# EAGLE schematic TSOC_RS485_EM_R4_0 (EAGLE 6.6.0)
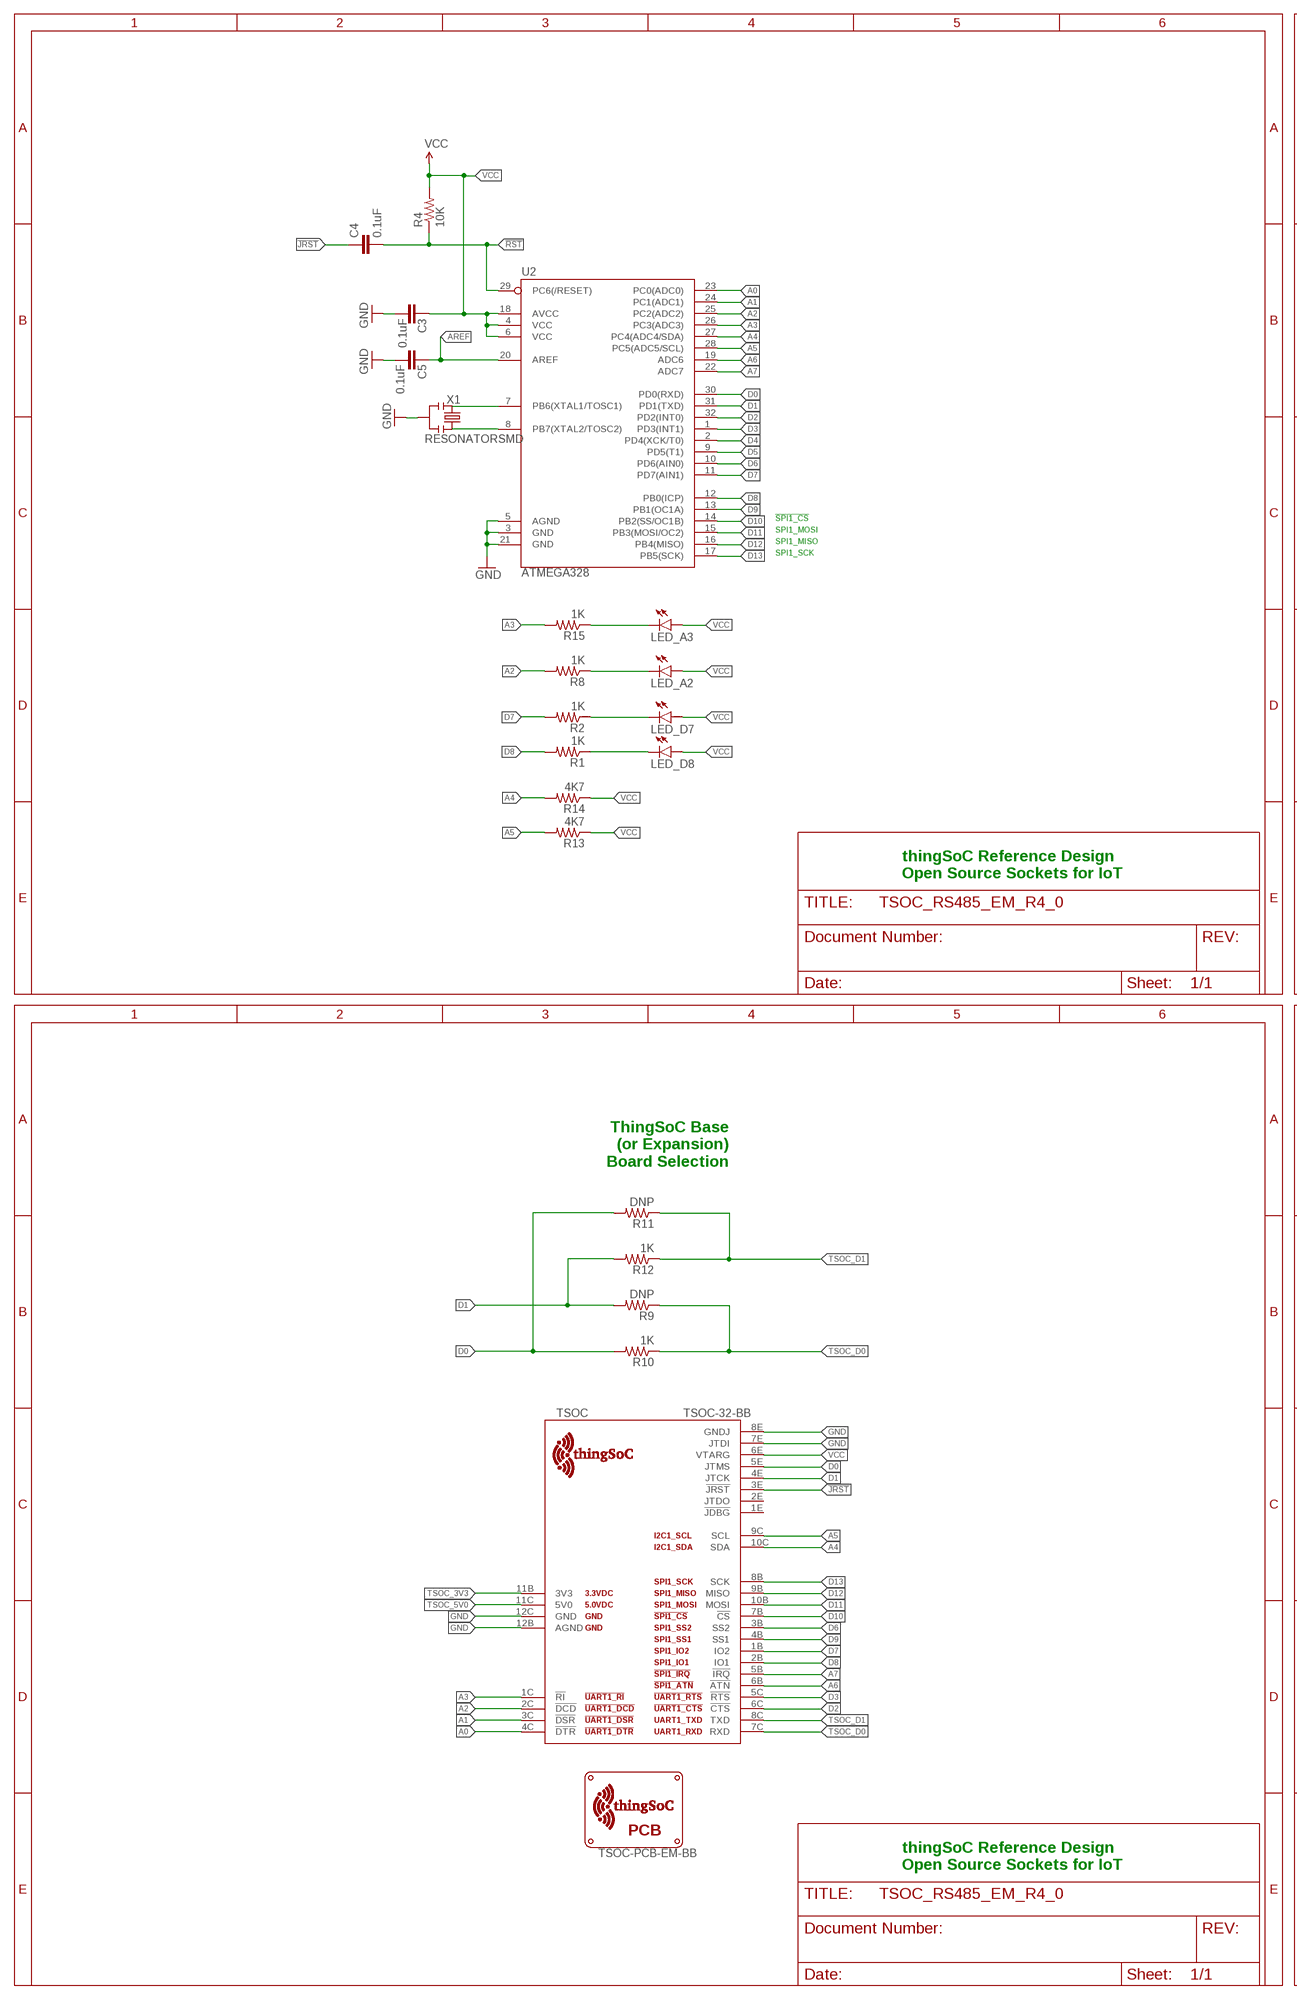
[diagram p0: schematic, sheet 1, part 1 of 2]
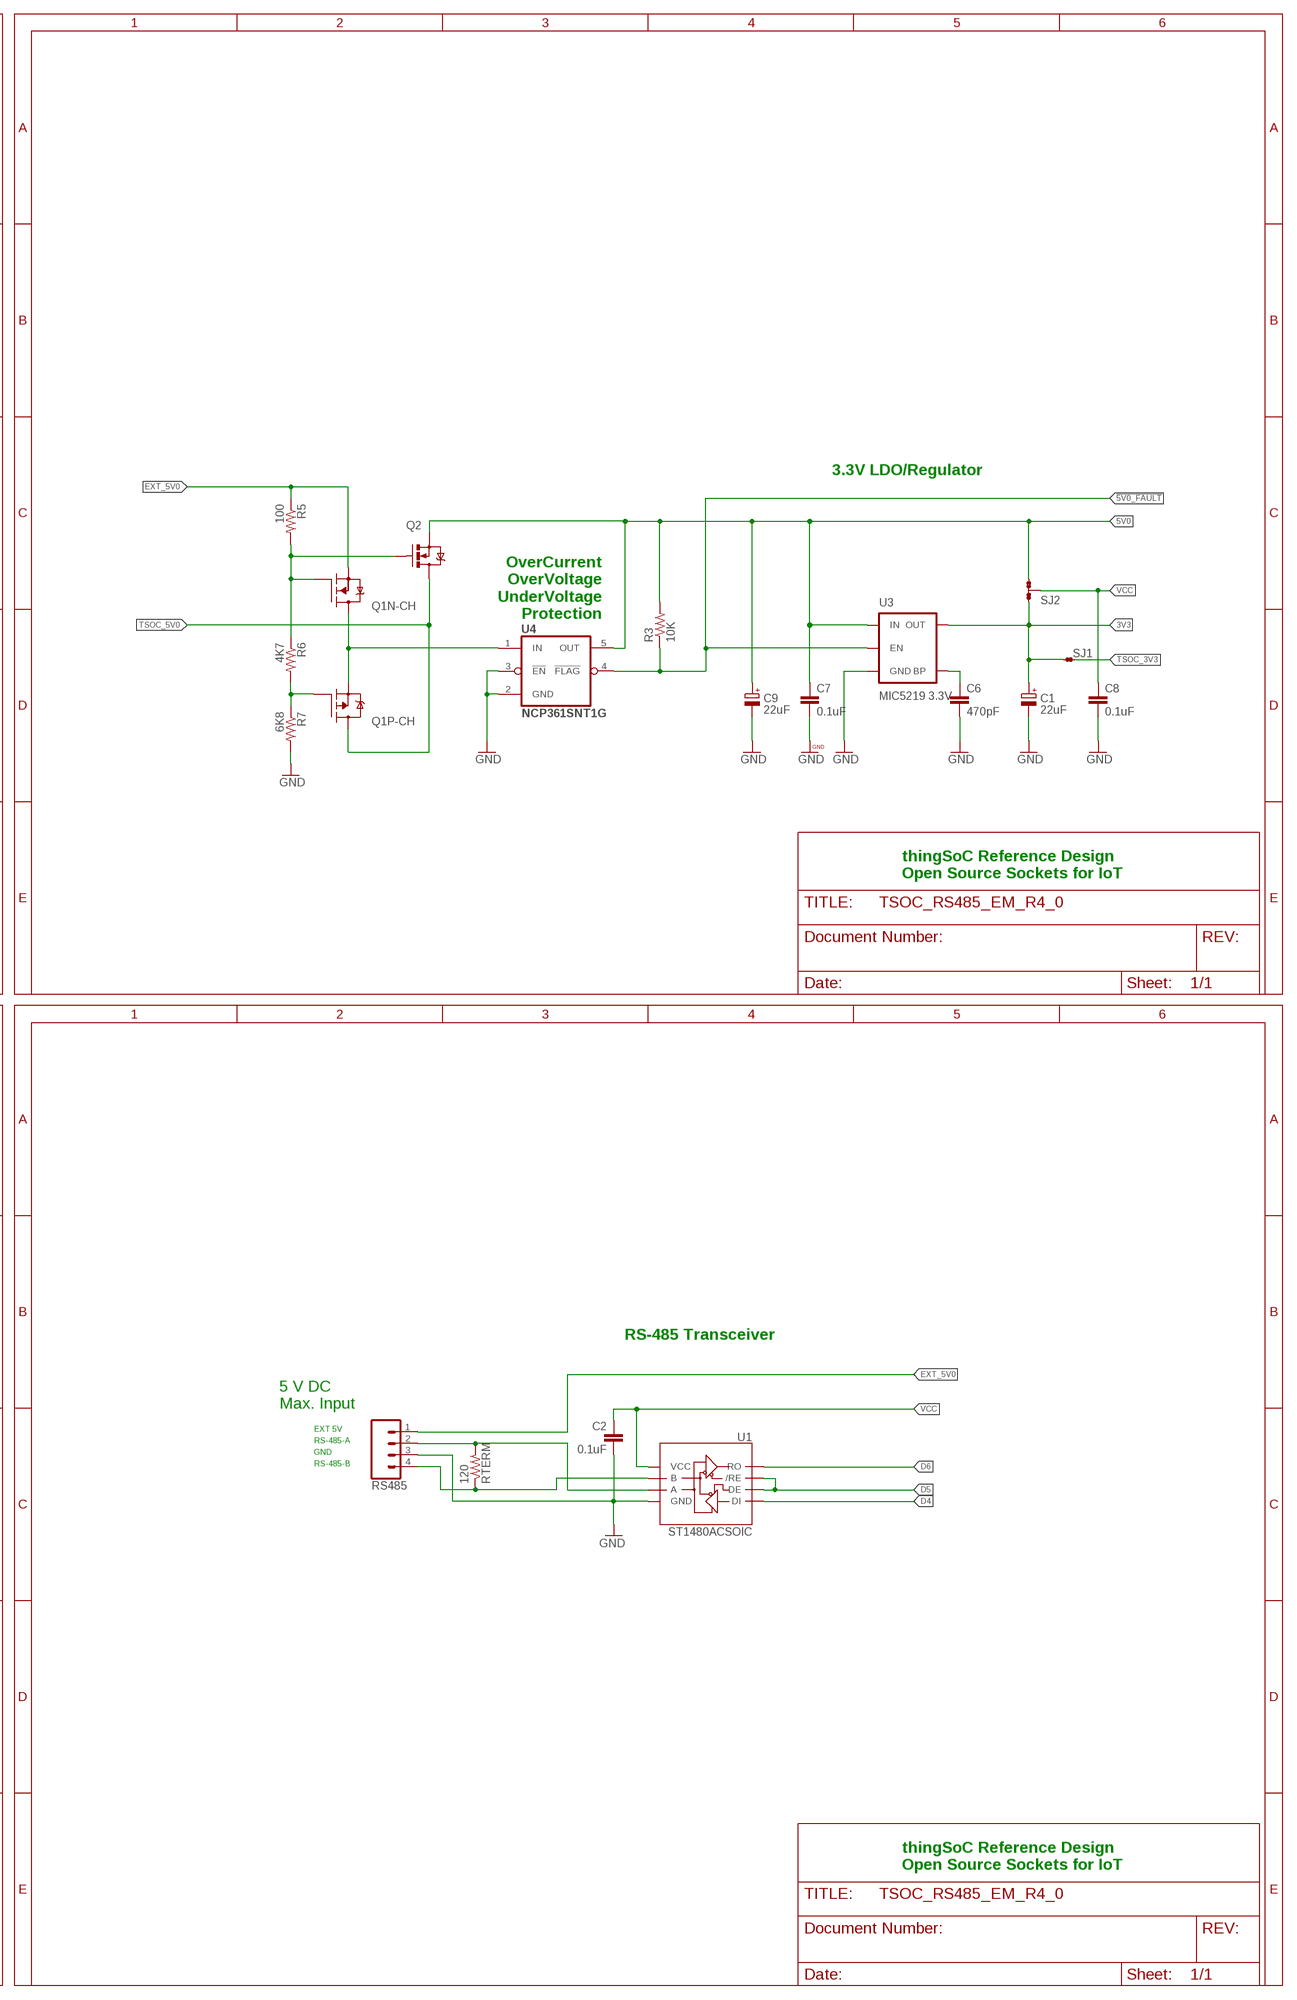
[diagram p1: schematic, sheet 1, part 2 of 2]

## Parts
C1  22uF  CPOL-EUSMCB  [SMC_B]
C2  0.1uF  CAP0402-CAP  [0402-CAP]
C3  0.1uF  CAP0402-CAP  [0402-CAP]
C4  0.1uF  CAP0402-CAP  [0402-CAP]
C5  0.1uF  CAP0402-CAP  [0402-CAP]
C6  470pF  CAP0402-CAP  [0402-CAP]
C7  0.1uF  CAP0402-CAP  [0402-CAP]
C8  0.1uF  CAP0402-CAP  [0402-CAP]
C9  22uF  CPOL-EUSMCB  [SMC_B]
LED_A2  LED0603  [LED-0603]
LED_A3  LED0603  [LED-0603]
LED_D7  LED0603  [LED-0603]
LED_D8  LED0603  [LED-0603]
Q1  FDC6420C  [SOT95P280X110-6N]
Q2  MOSFET-NCHANNELAO3404A  [SOT23-3]
R1  1K  RESISTOR0402  [0402-RES]
R2  1K  RESISTOR0402  [0402-RES]
R3  10K  RESISTOR0402  [0402-RES]
R4  10K  RESISTOR0402  [0402-RES]
R5  100  RESISTOR0402  [0402-RES]
R6  4K7  RESISTOR0402  [0402-RES]
R7  6K8  RESISTOR0402  [0402-RES]
R8  1K  RESISTOR0402  [0402-RES]
R9  DNP  RESISTOR0402  [0402-RES]
R10  1K  RESISTOR0402  [0402-RES]
R11  DNP  RESISTOR0402  [0402-RES]
R12  1K  RESISTOR0402  [0402-RES]
R13  4K7  RESISTOR0402  [0402-RES]
R14  4K7  RESISTOR0402  [0402-RES]
R15  1K  RESISTOR0402  [0402-RES]
RS485  M04SCREW  [SCREWTERMINAL-3.5MM-4]
RTERM  120  RESISTOR0402  [0402-RES]
SJ1  JMP-2-NC  [JMP-2-NC]
SJ2  JMP-3-1_2  [JMP-3-1_2]
TSOC  TSOC-32-BB  [TSOC-BB-S32]
U1  ST1480ACSOIC  [SO08]
U2  ATMEGA328  ATMEGA168  [TQFP32-08]
U3  MIC5219 3.3V  V_REG_MIC52193.3V  [SOT23-5]
U4  NCP361SNT1G  [SOP95P275X110-5N]
U$1  TSOC-PCB-EM-BB  [TSOC-EM-BB]
X1  RESONATORSMD  [RESONATOR-SMD]

## Nets
3V3: C1.+ SJ1.1 SJ2.1 U3.5(OUT)
5V0: C7.1 C9.+ Q2.2(S) R3.2 SJ2.3 U3.1(IN) U4.5(OUT)
!5V0_FAULT: R3.1 U3.3(EN) U4.4(!FLAG)
!JRST: C4.1 TSOC.3E(!JRST)
!RST: C4.2 R4.1 U2.29(PC6(/RESET))
A: RS485.4 RTERM.1 U1.7(B)
A0: TSOC.4C(!DTR) U2.23(PC0(ADC0))
A1: TSOC.3C(!DSR) U2.24(PC1(ADC1))
A2: R8.2 TSOC.2C(!DCD) U2.25(PC2(ADC2))
A3: R15.2 TSOC.1C(!RI) U2.26(PC3(ADC3))
A4: R14.2 TSOC.10C(SDA) U2.27(PC4(ADC4/SDA))
A5: R13.2 TSOC.9C(SCL) U2.28(PC5(ADC5/SCL))
A6: TSOC.6B(!ATN) U2.19(ADC6)
A7: TSOC.5B(!IRQ) U2.22(ADC7)
AREF: C5.2 U2.20(AREF)
B: RS485.2 RTERM.2 U1.6(A)
BYPASS1: C6.1 U3.4(BP)
D0: R10.2 R11.2 TSOC.5E(JTMS) U2.30(PD0(RXD))
D1: R9.2 R12.2 TSOC.4E(JTCK) U2.31(PD1(TXD))
D2: TSOC.6C(!CTS) U2.32(PD2(INT0))
D3: TSOC.5C(!RTS) U2.1(PD3(INT1))
D4: U1.4(DI) U2.2(PD4(XCK/T0))
D5: U1.2(/RE) U1.3(DE) U2.9(PD5(T1))
D6: TSOC.3B(SS2) U1.1(RO) U2.10(PD6(AIN0))
D7: R2.2 TSOC.1B(IO2) U2.11(PD7(AIN1))
D8: R1.2 TSOC.2B(IO1) U2.12(PB0(ICP))
D9: TSOC.4B(SS1) U2.13(PB1(OC1A))
D10: TSOC.7B(!CS) U2.14(PB2(SS/OC1B))
D11: TSOC.10B(MOSI) U2.15(PB3(MOSI/OC2))
D12: TSOC.9B(MISO) U2.16(PB4(MISO))
D13: TSOC.8B(SCK) U2.17(PB5(SCK))
EXT_5V0: Q1.5(N-CH:S) R5.1 RS485.1
GND: C1.- C2.2 C3.1 C5.1 C6.2 C7.2 C8.2 C9.- R7.2 RS485.3 TSOC.7E(JTDI) TSOC.8E(GNDJ) TSOC.12B(AGND) TSOC.12C(GND) U1.5(GND) U2.3(GND) U2.5(AGND) U2.21(GND) U3.2(GND) U4.2(GND) U4.3(!EN) X1.2
LED_A2: LED_A2.C R8.1
N$2: LED_D7.C R2.1
N$3: LED_A3.C R15.1
N$4: LED_D8.C R1.1
NGATE: Q1.1(N-CH:G) Q2.1(G) R5.2 R6.1
PGATE: Q1.3(P-CH:G) R6.2 R7.1
TSOC_3V3: SJ1.2 TSOC.11B(3V3)
TSOC_5V0: Q1.4(P-CH:D) Q2.3(D) TSOC.11C(5V0)
TSOC_D0: R9.1 R10.1 TSOC.7C(RXD)
TSOC_D1: R11.1 R12.1 TSOC.8C(TXD)
VCC: C2.1 C3.2 C8.1 LED_A2.A LED_A3.A LED_D7.A LED_D8.A R4.2 R13.1 R14.1 SJ2.2 TSOC.6E(VTARG) U1.8(VCC) U2.4(VCC) U2.6(VCC) U2.18(AVCC)
VIN: Q1.2(P-CH:S) Q1.6(N-CH:D) U4.1(IN)
XIN: U2.7(PB6(XTAL1/TOSC1)) X1.3
XOUT: U2.8(PB7(XTAL2/TOSC2)) X1.1
Unconnected: TSOC.1E(!JDBG) TSOC.2E(JTDO)

## Notes on the sheet
- 3.3V LDO/Regulator
- !SPI1_CS
- SPI1_MOSI
- SPI1_MISO
- SPI1_SCK
- OverCurrent
  OverVoltage
  UnderVoltage
  Protection
- thingSoC Reference Design
  Open Source Sockets for IoT
- thingSoC Reference Design
  Open Source Sockets for IoT
- ThingSoC Base
  (or Expansion)
  Board Selection
- RS-485 Transceiver
- 5 V DC 
  Max. Input
- EXT 5V
- RS-485-A
- GND
- RS-485-B
- thingSoC Reference Design
  Open Source Sockets for IoT
- thingSoC Reference Design
  Open Source Sockets for IoT

## Library data of the parts
C1 C9 = rcl:CPOL-EU: POLARIZED CAPACITOR, European symbol
C2-C8 = TSOC-MODBUS-ESM:CAP: Capacitor Standard 0603 ceramic capacitor, and 0.1" leaded capacitor.
LED_A2 LED_A3 LED_D7 LED_D8 = TSOC-MODBUS-ESM:LED: LEDs Standard schematic elements and footprints for 5mm, 3mm, 1206, and 0603 sized LEDs. 5mm - Spark Fun Electronics SKU : COM-00529 (and others)
Q1 = TSOC-ESP8266-BASE:FDC6420C: N and P Channel Power Trench MOSFETs
Q2 = SparkFun-DiscreteSemi:MOSFET-NCHANNEL: Common NMOSFET Parts MFG P/N Store ID Prod ID FDD8780 TRANS-09984 SI7820DN TRANS-11055 FDS6630A IC-08089 2N7002PW TRANS-11151 FQP30N06L COM-10213 TRANS-10060 BSS123LT1G TRANS-08345 BSS138 TRANS-00830 BS170 2N7000; PROD_ID: TRAN-12988
R1-R15 RTERM = TSOC-MODBUS-ESM:RESISTOR: Resistor Basic schematic elements and footprints for 0603, 1206, and PTH resistors.
RS485 = SparkFun-Connectors:M04: Header 4 Standard 4-pin 0.1" header. Use with straight break away headers (SKU : PRT-00116), right angle break away headers (PRT-00553), swiss pins (PRT-00743), machine pins (PRT-00117), and female headers (PRT-00115). Molex polarized connector foot print use with SKU : PRT-08231 with associated crimp pins and housings. 1MM SMD Version SKU: PRT-10208
SJ1 = TSOC-MODBUS-ESM:JMP-2-NC: Two Terminal Jumper - Normally Closed Positions 1 and 2 are normally connected. PatternAgents ProtoPads Library Schematic and PCB layout libraries for design patterns by PatternAgents. For the CADSoft Eagle CAD program : http://www.cadsoftusa.com/download-eagle/ Source LBR : http://www.patternagents.com Github : https://github.com/PatternAgents License : http://creativecommons.org/licenses/by-sa/4.0/ (Creative Commons 4.0) THIS SOFTWARE IS PROVIDED BY THE CONTRIBUTORS "AS IS" AND WITHOUT ANY EXPRESS OR IMPLIED WARRANTIES, INCLUDING, BUT NOT LIMITED TO, THE IMPLIED WARRANTIES OF MERCHANTABILITY AND FITNESS FOR A PARTICULAR PURPOSE ARE DISCLAIMED. IN NO EVENT SHALL THE COPYRIGHT OWNER OR CONTRIBUTORS BE LIABLE FOR ANY DIRECT, INDIRECT, INCIDENTAL, SPECIAL, EXEMPLARY, OR CONSEQUENTIAL DAMAGES (INCLUDING, BUT NOT LIMITED TO, PROCUREMENT OF SUBSTITUTE GOODS OR SERVICES; LOSS OF USE, DATA, OR PROFITS; OR BUSINESS INTERRUPTION) HOWEVER CAUSED AND ON ANY THEORY OF LIABILITY, WHETHER IN CONTRACT, STRICT LIABILITY, OR TORT (INCLUDING NEGLIGENCE OR OTHERWISE) ARISING IN ANY WAY OUT OF THE USE OF THIS SOFTWARE, EVEN IF ADVISED OF THE POSSIBILITY OF SUCH DAMAGE.; BOM: EXCLUDE
SJ2 = PatternAgents-ProtoPads:JMP-3-1_2: Three Terminal Jumper - 1 & 2 Connected Positions 1and 2 are normally connected. PatternAgents ProtoPads Library Schematic and PCB layout libraries for design patterns by PatternAgents. For the CADSoft Eagle CAD program : http://www.cadsoftusa.com/download-eagle/ Source LBR : http://www.patternagents.com Github : https://github.com/PatternAgents License : http://creativecommons.org/licenses/by-sa/4.0/ (Creative Commons 4.0) THIS SOFTWARE IS PROVIDED BY THE CONTRIBUTORS "AS IS" AND WITHOUT ANY EXPRESS OR IMPLIED WARRANTIES, INCLUDING, BUT NOT LIMITED TO, THE IMPLIED WARRANTIES OF MERCHANTABILITY AND FITNESS FOR A PARTICULAR PURPOSE ARE DISCLAIMED. IN NO EVENT SHALL THE COPYRIGHT OWNER OR CONTRIBUTORS BE LIABLE FOR ANY DIRECT, INDIRECT, INCIDENTAL, SPECIAL, EXEMPLARY, OR CONSEQUENTIAL DAMAGES (INCLUDING, BUT NOT LIMITED TO, PROCUREMENT OF SUBSTITUTE GOODS OR SERVICES; LOSS OF USE, DATA, OR PROFITS; OR BUSINESS INTERRUPTION) HOWEVER CAUSED AND ON ANY THEORY OF LIABILITY, WHETHER IN CONTRACT, STRICT LIABILITY, OR TORT (INCLUDING NEGLIGENCE OR OTHERWISE) ARISING IN ANY WAY OUT OF THE USE OF THIS SOFTWARE, EVEN IF ADVISED OF THE POSSIBILITY OF SUCH DAMAGE.; BOM: EXCLUDE
TSOC = thingSoC:TSOC-32: thingSoC Thirty-Two (32) Pin Socket Source LBR : http://www.thingsoc.com Github : https://github.com/thingsoc License : http://creativecommons.org/licenses/by-sa/4.0/ (Creative Commons 4.0) THIS SOFTWARE IS PROVIDED BY THE CONTRIBUTORS "AS IS" AND WITHOUT ANY EXPRESS OR IMPLIED WARRANTIES, INCLUDING, BUT NOT LIMITED TO, THE IMPLIED WARRANTIES OF MERCHANTABILITY AND FITNESS FOR A PARTICULAR PURPOSE ARE DISCLAIMED. IN NO EVENT SHALL THE COPYRIGHT OWNER OR CONTRIBUTORS BE LIABLE FOR ANY DIRECT, INDIRECT, INCIDENTAL, SPECIAL, EXEMPLARY, OR CONSEQUENTIAL DAMAGES (INCLUDING, BUT NOT LIMITED TO, PROCUREMENT OF SUBSTITUTE GOODS OR SERVICES; LOSS OF USE, DATA, OR PROFITS; OR BUSINESS INTERRUPTION) HOWEVER CAUSED AND ON ANY THEORY OF LIABILITY, WHETHER IN CONTRACT, STRICT LIABILITY, OR TORT (INCLUDING NEGLIGENCE OR OTHERWISE) ARISING IN ANY WAY OUT OF THE USE OF THIS SOFTWARE, EVEN IF ADVISED OF THE POSSIBILITY OF SUCH DAMAGE.
U1 = TSOC-MODBUS-ESM:ST1480AC: ST Microelectronics ST1480AC RS-485/RS-422 Transceiver Source : http://www.st.com/web/en/resource/technical/document/datasheet/CD00003136.pdf The ST1480Ax is ±15 kV ESD protected, 3.3 V low power transceiver for RS-485 and RS-422 communications. The device contains one driver and one receiver in half duplex configuration. The ST1480Ax transmits and receives at a guaranteed data rate of at least 12 Mbps. All transmitter outputs and receiver inputs are protected to ±15 kV using Human Body Model. Driver is short-circuit current limited and is protected against excessive power dissipation by thermal shutdown circuitry that places the driver outputs into a high-impedance state. The ST1480Ax input has a true fail-safe feature that guarantees a logic high output if both inputs are open circuit, shorted together or in the presence of a termination with no signal on the bus.
U2 = SparkFun:ATMEGA168
U3 = TSOC-ESP8266-BASE:V_REG_MIC5219: V_REG MIC5219 Standard 3.3V and 5V 500mA LDO voltage regulator in SOT-23 layout. Micrel part MIC5219. BP (by-pass) pin is used to lower output noise with 470pF cap, may be left open.; PROD_ID: VREG-09872
U4 = TSOC-ESP8266-BASE:NCP361SNT1G: USB Positive Overvoltage Protection Controller; MPN: NCP361SNT1G; OC_FARNELL: 1642242; OC_NEWARK: 01P0135; PACKAGE: TSOP-5; SUPPLIER: ON Semiconductor
U$1 = TSOC-MODBUS-ESM:TSOC-PCB: thingSoC PCB Outlines Boards Outlines for Standard Sizes (in the DImension Layer) (Registration marks in the tDocu layer - make sure to turn on tDocu/bDocu) Source LBR : http://www.thingsoc.com Github : https://github.com/thingsoc License : http://creativecommons.org/licenses/by-sa/4.0/ (Creative Commons 4.0) THIS SOFTWARE IS PROVIDED BY THE CONTRIBUTORS "AS IS" AND WITHOUT ANY EXPRESS OR IMPLIED WARRANTIES, INCLUDING, BUT NOT LIMITED TO, THE IMPLIED WARRANTIES OF MERCHANTABILITY AND FITNESS FOR A PARTICULAR PURPOSE ARE DISCLAIMED. IN NO EVENT SHALL THE COPYRIGHT OWNER OR CONTRIBUTORS BE LIABLE FOR ANY DIRECT, INDIRECT, INCIDENTAL, SPECIAL, EXEMPLARY, OR CONSEQUENTIAL DAMAGES (INCLUDING, BUT NOT LIMITED TO, PROCUREMENT OF SUBSTITUTE GOODS OR SERVICES; LOSS OF USE, DATA, OR PROFITS; OR BUSINESS INTERRUPTION) HOWEVER CAUSED AND ON ANY THEORY OF LIABILITY, WHETHER IN CONTRACT, STRICT LIABILITY, OR TORT (INCLUDING NEGLIGENCE OR OTHERWISE) ARISING IN ANY WAY OUT OF THE USE OF THIS SOFTWARE, EVEN IF ADVISED OF THE POSSIBILITY OF SUCH DAMAGE.
X1 = SparkFun:RESONATOR: Resonator Small SMD resonator. This is the itty bitty 10/20MHz resonators with built in caps. CSTCE10M0G55 and CSTCE20M0V53. Footprint has been reviewed closely but hasn't been tested yet.

## Net classes
1 vcc: width 0.254 mm